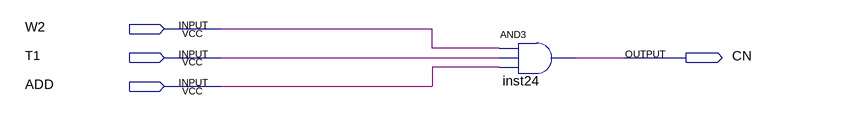
[diagram p0: schematic sheet]
// Quartus schematic CN.bdf as structural Verilog: 1 symbols, 4 pins
module CN (
  input  W2,
  input  T1,
  input  ADD,
  output CN
);

  and inst24 (CN, W2, T1, ADD);
endmodule
